# Altium schematic sheet Power.SchDoc: 3V3 Voltage Regulator
size A; Revision: 1
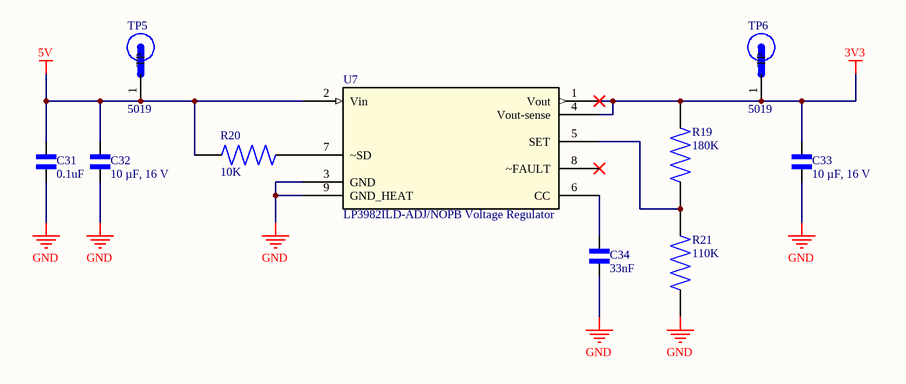
[diagram p0: Power.SchDoc]

## Parts
C31  0.1uF  [C0402]
C32  10 µF, 16 V  [C0805]
C33  10 µF, 16 V  [C0805]
C34  33nF  [C0402]
R19  180K  [R0603 Vishay]
R20  10K  [R0603 Vishay]
R21  110K  [R0603 Vishay]
TP5  5019  [TP380X203]
TP6  5019  [TP380X203]
U7  LP3982ILD-ADJ/NOPB Voltage Regulator  [LP3982ILD-ADJ]

## Nets
3V3: C33.2 R19.2 TP6.1(TP) U7.1(Vout) U7.4(Vout-sense)
5V: C31.2 C32.2 R20.1 TP5.1(TP) U7.2(Vin)
GND: C31.1 C32.1 C33.1 C34.1 R21.1 U7.3(GND) U7.9(GND_HEAT)
NetC34_2: C34.2 U7.6(CC)
NetR19_1: R19.1 R21.2 U7.5(SET)
NetR20_2: R20.2 U7.7(~SD)

Not connected (* = marked no-connect by the designer): U7 8(~FAULT)*

## Library data of the parts
C31 = GRM022R60J104KE15L: CAP CER 0.1UF 6.3V X5R 01005; Manufacturer: Murata; Capacitance: 100nF; Tolerance: 10%; Supplier 1: Digi-Key; Manufacturer Part Number: GRM022R60J104KE15L; RoHS: No; Category: Ceramic Capacitors; Stock 1: 633064; Pricing 1: 1=0.13000, 10=0.09000, 50=0.05080, 100=0.04210, 500=0.02952, 1000=0.02444, 2500=0.02275, 5000=0.02081 (USD); Mount: Surface Mount; Case Code (Imperial): 1005; Case Code (Metric): 0402; Min Operating Temperature: -55°C; Max Operating Temperature: 85°C; Packaging: Cut Tape; Voltage Rating: 6.3V; ComponentLink1URL: http://search.murata.co.jp/Ceramy/image/img/A01X/G101/ENG/GRM022R60J104KE15-01.pdf?src-supplier=Digi-Key; ComponentLink1Description: http://search.murata.co.jp/Ceramy/image/img/A01X/G101/ENG/GRM022R60J104KE15-01.pdf?src-supplier=Digi-Key; Supplier Part Number 1: 490-16598-1-ND
C32 C33 = C2012X5R1C106K085AC: TDK - C2012X5R1C106K085AC - SMD Multilayer Ceramic Capacitor, 10 µF, 16 V, 0805 [2012 Metric], ± 10%, X5R, C Series TDK; Capacitance: 10uF; Voltage Rating: 16V; Supplier 1: Digi-Key; Manufacturer: TDK; Manufacturer Part Number: C2012X5R1C106K085AC; RoHS: Yes; Category: Ceramic Capacitors; Stock 1: 1442350; Pricing 1: 1=0.25000, 10=0.17500, 100=0.09890, 500=0.06982, 1000=0.06110 (USD); Mount: Surface Mount; Case/Package: 0805; Number of Pins: 2; Weight: 0.000194oz; Case Code (Metric): 2012; Case Code (Imperial): 0805; Dielectric Material: Ceramic; Min Operating Temperature: -55°C; Max Operating Temperature: 85°C; Tolerance: 10%; Packaging: Tape and Reel; Voltage Rating (DC): 16V; Termination: SMD/SMT; Dielectric: X5R; Package Quantity: 1; Composition: Ceramic; Length: 2mm; Height: 0.85mm; Depth: 1.25mm; Width: 0.049inch; Thickness: 0.037inch; Lead Free: Lead Free; REACH SVHC: No SVHC; ComponentLink1URL: https://datasheet.ciiva.com/24218/c2012x5r1c106k085ac-264980-24218056.pdf?src-supplier=Mouser; ComponentLink1Description: https://datasheet.ciiva.com/24218/c2012x5r1c106k085ac-264980-24218056.pdf?src-supplier=Mouser; ComponentLink2URL: https://datasheet.ciiva.com/28451/1796654-28451610.pdf?src-supplier=Element14; ComponentLink2Description: https://datasheet.ciiva.com/28451/1796654-28451610.pdf?src-supplier=Element14; ComponentLink3URL: https://datasheet.ciiva.com/28602/1744655-28602170.pdf?src-supplier=Element14; ComponentLink3Description: https://datasheet.ciiva.com/28602/1744655-28602170.pdf?src-supplier=Element14; ComponentLink4URL: https://datasheet.ciiva.com/6259/tdkmlcccaprange-6259116.pdf?src-supplier=Digi-Key; ComponentLink4Description: https://datasheet.ciiva.com/6259/tdkmlcccaprange-6259116.pdf?src-supplier=Digi-Key; ComponentLink5URL: https://datasheet.ciiva.com/23803/1796654-23803020.pdf?src-supplier=Newark; ComponentLink5Description: https://datasheet.ciiva.com/23803/1796654-23803020.pdf?src-supplier=Newark; ComponentLink6URL: https://datasheet.ciiva.com/22719/1796654-22719549.pdf?src-supplier=Element14; ComponentLink6Description: https://datasheet.ciiva.com/22719/1796654-22719549.pdf?src-supplier=Element14; ComponentLink7URL: https://datasheet.ciiva.com/6259/tdkmlcccaprange-6259119.pdf?src-supplier=Digi-Key; ComponentLink7Description: https://datasheet.ciiva.com/6259/tdkmlcccaprange-6259119.pdf?src-supplier=Digi-Key; ComponentLink8URL: https://datasheet.ciiva.com/28673/mlcc-commercial-general-en-28673535.pdf?src-supplier=Element14; ComponentLink8Description: https://datasheet.ciiva.com/28673/mlcc-commercial-general-en-28673535.pdf?src-supplier=Element14; Supplier Part Number 1: 445-7644-1-ND
C34 = CM02X5R333K06AH: Multilayer Ceramic Capacitors MLCC - SMD/SMT 6.3V 0.033uF X5R 01005 10%; Manufacturer: Kyocera AVX; Supplier 1: Digi-Key; Manufacturer Part Number: CM02X5R333K06AH; RoHS: No; Stock 1: 20000; Pricing 1: 1=0.10000, 10=0.04800, 50=0.02640, 100=0.02160, 500=0.01540, 1000=0.01210, 2500=0.01100, 5000=0.01012 (USD); Supplier Part Number 1: 1253-CM02X5R333K06AHCT-ND
R19 = CRCW0201180KFNED: VISHAY - CRCW0201180KFNED - SMD Chip Resistor, 0201 [0603 Metric], 180 kohm, CRCW e3 Series, 30 V, Thick Film, 50 mW; Resistance: 180kR; Power Rating: 50mW; Tolerance: 1%; Voltage Rating: 30V; Temperature Coefficient: 200ppm/°C; Supplier 1: Digi-Key; Manufacturer: Vishay; Manufacturer Part Number: CRCW0201180KFNED; RoHS: Yes; Category: Chip SMD Resistors; Stock 1: 10120; Pricing 1: 1=0.10000, 10=0.05700, 100=0.02300, 1000=0.01034, 2500=0.00897, 5000=0.00741 (USD); Case/Package: 0201; Case Code (Metric): 0603; Case Code (Imperial): 0201; Contact Plating: Tin; Min Operating Temperature: -55°C; Max Operating Temperature: 155°C; Packaging: Tape and Reel; Resistor Type: Thick Film; Voltage Rating (DC): 30V; Length: 600um; Width: 300um; Height: 230um; Radiation Hardening: No; REACH SVHC: Unknown; Lead Free: Lead Free; ComponentLink1URL: https://datasheet.ciiva.com/22665/1700795-22665798.pdf?src-supplier=Element14; ComponentLink1Description: https://datasheet.ciiva.com/22665/1700795-22665798.pdf?src-supplier=Element14; ComponentLink2URL: https://datasheet.ciiva.com/22692/1719906-22692745.pdf?src-supplier=Element14; ComponentLink2Description: https://datasheet.ciiva.com/22692/1719906-22692745.pdf?src-supplier=Element14; ComponentLink3URL: https://datasheet.ciiva.com/7714/1719906-7714127.pdf?src-supplier=Element14; ComponentLink3Description: https://datasheet.ciiva.com/7714/1719906-7714127.pdf?src-supplier=Element14; Supplier Part Number 1: 541-CRCW0201180KFNEDCT-ND
R20 = CRCW020110K0FNED: VISHAY - CRCW020110K0FNED. - Surface Mount Thick Film Resistor, AEC-Q200 CRCW Series, 10 kohm, 50 mW, -  1%, 30 V RoHS Compliant: Yes; Resistance: 10kR; Power Rating: 50mW; Voltage Rating: 30V; Temperature Coefficient: 200ppm/°C; Supplier 1: Digi-Key; Manufacturer: Vishay; Manufacturer Part Number: CRCW020110K0FNED; RoHS: Yes; Category: Chip SMD Resistors; Stock 1: 567966; Pricing 1: 1=0.10000, 10=0.05700, 100=0.02300, 1000=0.01034, 2500=0.00897, 5000=0.00741 (USD); Mount: Surface Mount; Case/Package: 0201; Number of Pins: 2; Weight: 6E-06oz; Case Code (Imperial): 0201; Case Code (Metric): 0603; Contact Plating: Tin; Min Operating Temperature: -55°C; Max Operating Temperature: 155°C; Tolerance: 1%; Packaging: Tape and Reel; Package Quantity: 1; Termination: SMD/SMT; Resistor Type: Thick Film; Number of Terminations: 2; Max Power Dissipation: 50mW; Voltage Rating (DC): 30V; Length: 0.6mm; Width: 0.3mm; Height: 0.011inch; Depth: 0.3mm; Radiation Hardening: No; REACH SVHC: Unknown; Military Standard: Not; Lead Free: Lead Free; ComponentLink1URL: https://datasheet.ciiva.com/2474/crcw0201e3-2474818.pdf?src-supplier=Digi-Key; ComponentLink1Description: https://datasheet.ciiva.com/2474/crcw0201e3-2474818.pdf?src-supplier=Digi-Key; ComponentLink2URL: https://datasheet.ciiva.com/7983/1719906-7983320.pdf?src-supplier=Element14; ComponentLink2Description: https://datasheet.ciiva.com/7983/1719906-7983320.pdf?src-supplier=Element14; ComponentLink3URL: https://datasheet.ciiva.com/16436/dcrcwe3-16436222.pdf?src-supplier=Future+Electronics; ComponentLink3Description: https://datasheet.ciiva.com/16436/dcrcwe3-16436222.pdf?src-supplier=Future+Electronics; ComponentLink4URL: https://datasheet.ciiva.com/2474/crcw0201e3-2474819.pdf?src-supplier=Digi-Key; ComponentLink4Description: https://datasheet.ciiva.com/2474/crcw0201e3-2474819.pdf?src-supplier=Digi-Key; ComponentLink5URL: https://datasheet.ciiva.com/2474/crcw0201e3-2474820.pdf?src-supplier=Digi-Key; ComponentLink5Description: https://datasheet.ciiva.com/2474/crcw0201e3-2474820.pdf?src-supplier=Digi-Key; ComponentLink6URL: https://datasheet.ciiva.com/22692/1719906-22692709.pdf?src-supplier=Element14; ComponentLink6Description: https://datasheet.ciiva.com/22692/1719906-22692709.pdf?src-supplier=Element14; ComponentLink7URL: https://datasheet.ciiva.com/7983/1719906-7983319.pdf?src-supplier=Element14; ComponentLink7Description: https://datasheet.ciiva.com/7983/1719906-7983319.pdf?src-supplier=Element14; ComponentLink8URL: https://datasheet.ciiva.com/22868/70202042-22868839.pdf?src-supplier=Allied+Electronics; ComponentLink8Description: https://datasheet.ciiva.com/22868/70202042-22868839.pdf?src-supplier=Allied+Electronics; Supplier Part Number 1: 541-10.0KABCT-ND
R21 = CRCW0201110KFNED: RES SMD 110K OHM 1% 1/20W 0201; Manufacturer: Vishay; Resistance: 110kR; Power Rating: 50mW; Voltage Rating: 30V; Temperature Coefficient: 200ppm/°C; Supplier 1: Digi-Key; Manufacturer Part Number: CRCW0201110KFNED; RoHS: Yes; Category: Chip SMD Resistors; Stock 1: 6456; Pricing 1: 1=0.10000, 10=0.05700, 100=0.02300, 1000=0.01034, 2500=0.00897, 5000=0.00741 (USD); Case/Package: 0201; Case Code (Metric): 0603; Case Code (Imperial): 0201; Contact Plating: Tin; Min Operating Temperature: -55°C; Max Operating Temperature: 155°C; Package Quantity: 10000; Tolerance: 1%; Packaging: Tape and Reel; Resistor Type: Thick Film; Number of Terminations: 2; Max Power Dissipation: 50mW; Voltage Rating (DC): 30V; Length: 0.024inch; Width: 0.012inch; Height: 0.011inch; Radiation Hardening: No; REACH SVHC: Unknown; Lead Free: Lead Free; ComponentLink1URL: https://datasheet.ciiva.com/8977/crcw0201e3-8977608.pdf?src-supplier=Avnet; ComponentLink1Description: https://datasheet.ciiva.com/8977/crcw0201e3-8977608.pdf?src-supplier=Avnet; ComponentLink2URL: https://datasheet.ciiva.com/22692/1719906-22692712.pdf?src-supplier=Element14; ComponentLink2Description: https://datasheet.ciiva.com/22692/1719906-22692712.pdf?src-supplier=Element14; ComponentLink3URL: https://datasheet.ciiva.com/2577/crcw0201e3-2577313.pdf?src-supplier=Digi-Key; ComponentLink3Description: https://datasheet.ciiva.com/2577/crcw0201e3-2577313.pdf?src-supplier=Digi-Key; ComponentLink4URL: https://datasheet.ciiva.com/22665/1700795-22665706.pdf?src-supplier=Element14; ComponentLink4Description: https://datasheet.ciiva.com/22665/1700795-22665706.pdf?src-supplier=Element14; Supplier Part Number 1: 541-CRCW0201110KFNEDCT-ND
TP5 TP6 = 5019: PC Test Point, Miniature Phosphor Bronze, Silver Plating Surface Mount Mounting Type; MF: Keystone Electronics; Value: *; MP: 5019; Package: 2010 Keystone; SnapEDA_Link: https://www.snapeda.com/parts/5019/Keystone%20Electronics/view-part/449144/?ref=snap; Digi-Key_Part_Number: 36-5019CT-ND; Digi-Key_Purchase_URL: https://www.digikey.com/product-detail/en/keystone-electronics/5019/36-5019CT-ND/3907344?utm_source=snapeda&utm_medium=aggregator&utm_campaign=symbol
U7 = LP3982ILD-ADJ: https://www.ti.com/product/LP3982?HQS=TI-null-null-octopart-df-pf-null-wwe; Vendor: Texas Instruments; Built_By: EMA_UL_Team; SourceLibrary: TI_2019-03-28; Manufacturer_Part_Number: LP3982ILD-ADJ/NOPB; Copyright: Copyright (C) 2018 Accelerated Designs. All rights reserved; RefDes: RefDes; Type: DEV